# EasyEDA schematic NoiseGen2.json
TITLE: Sheet_1; REV: 1.0; Date: 2023-06-15; Sheet: 1/1; Company: Your Company
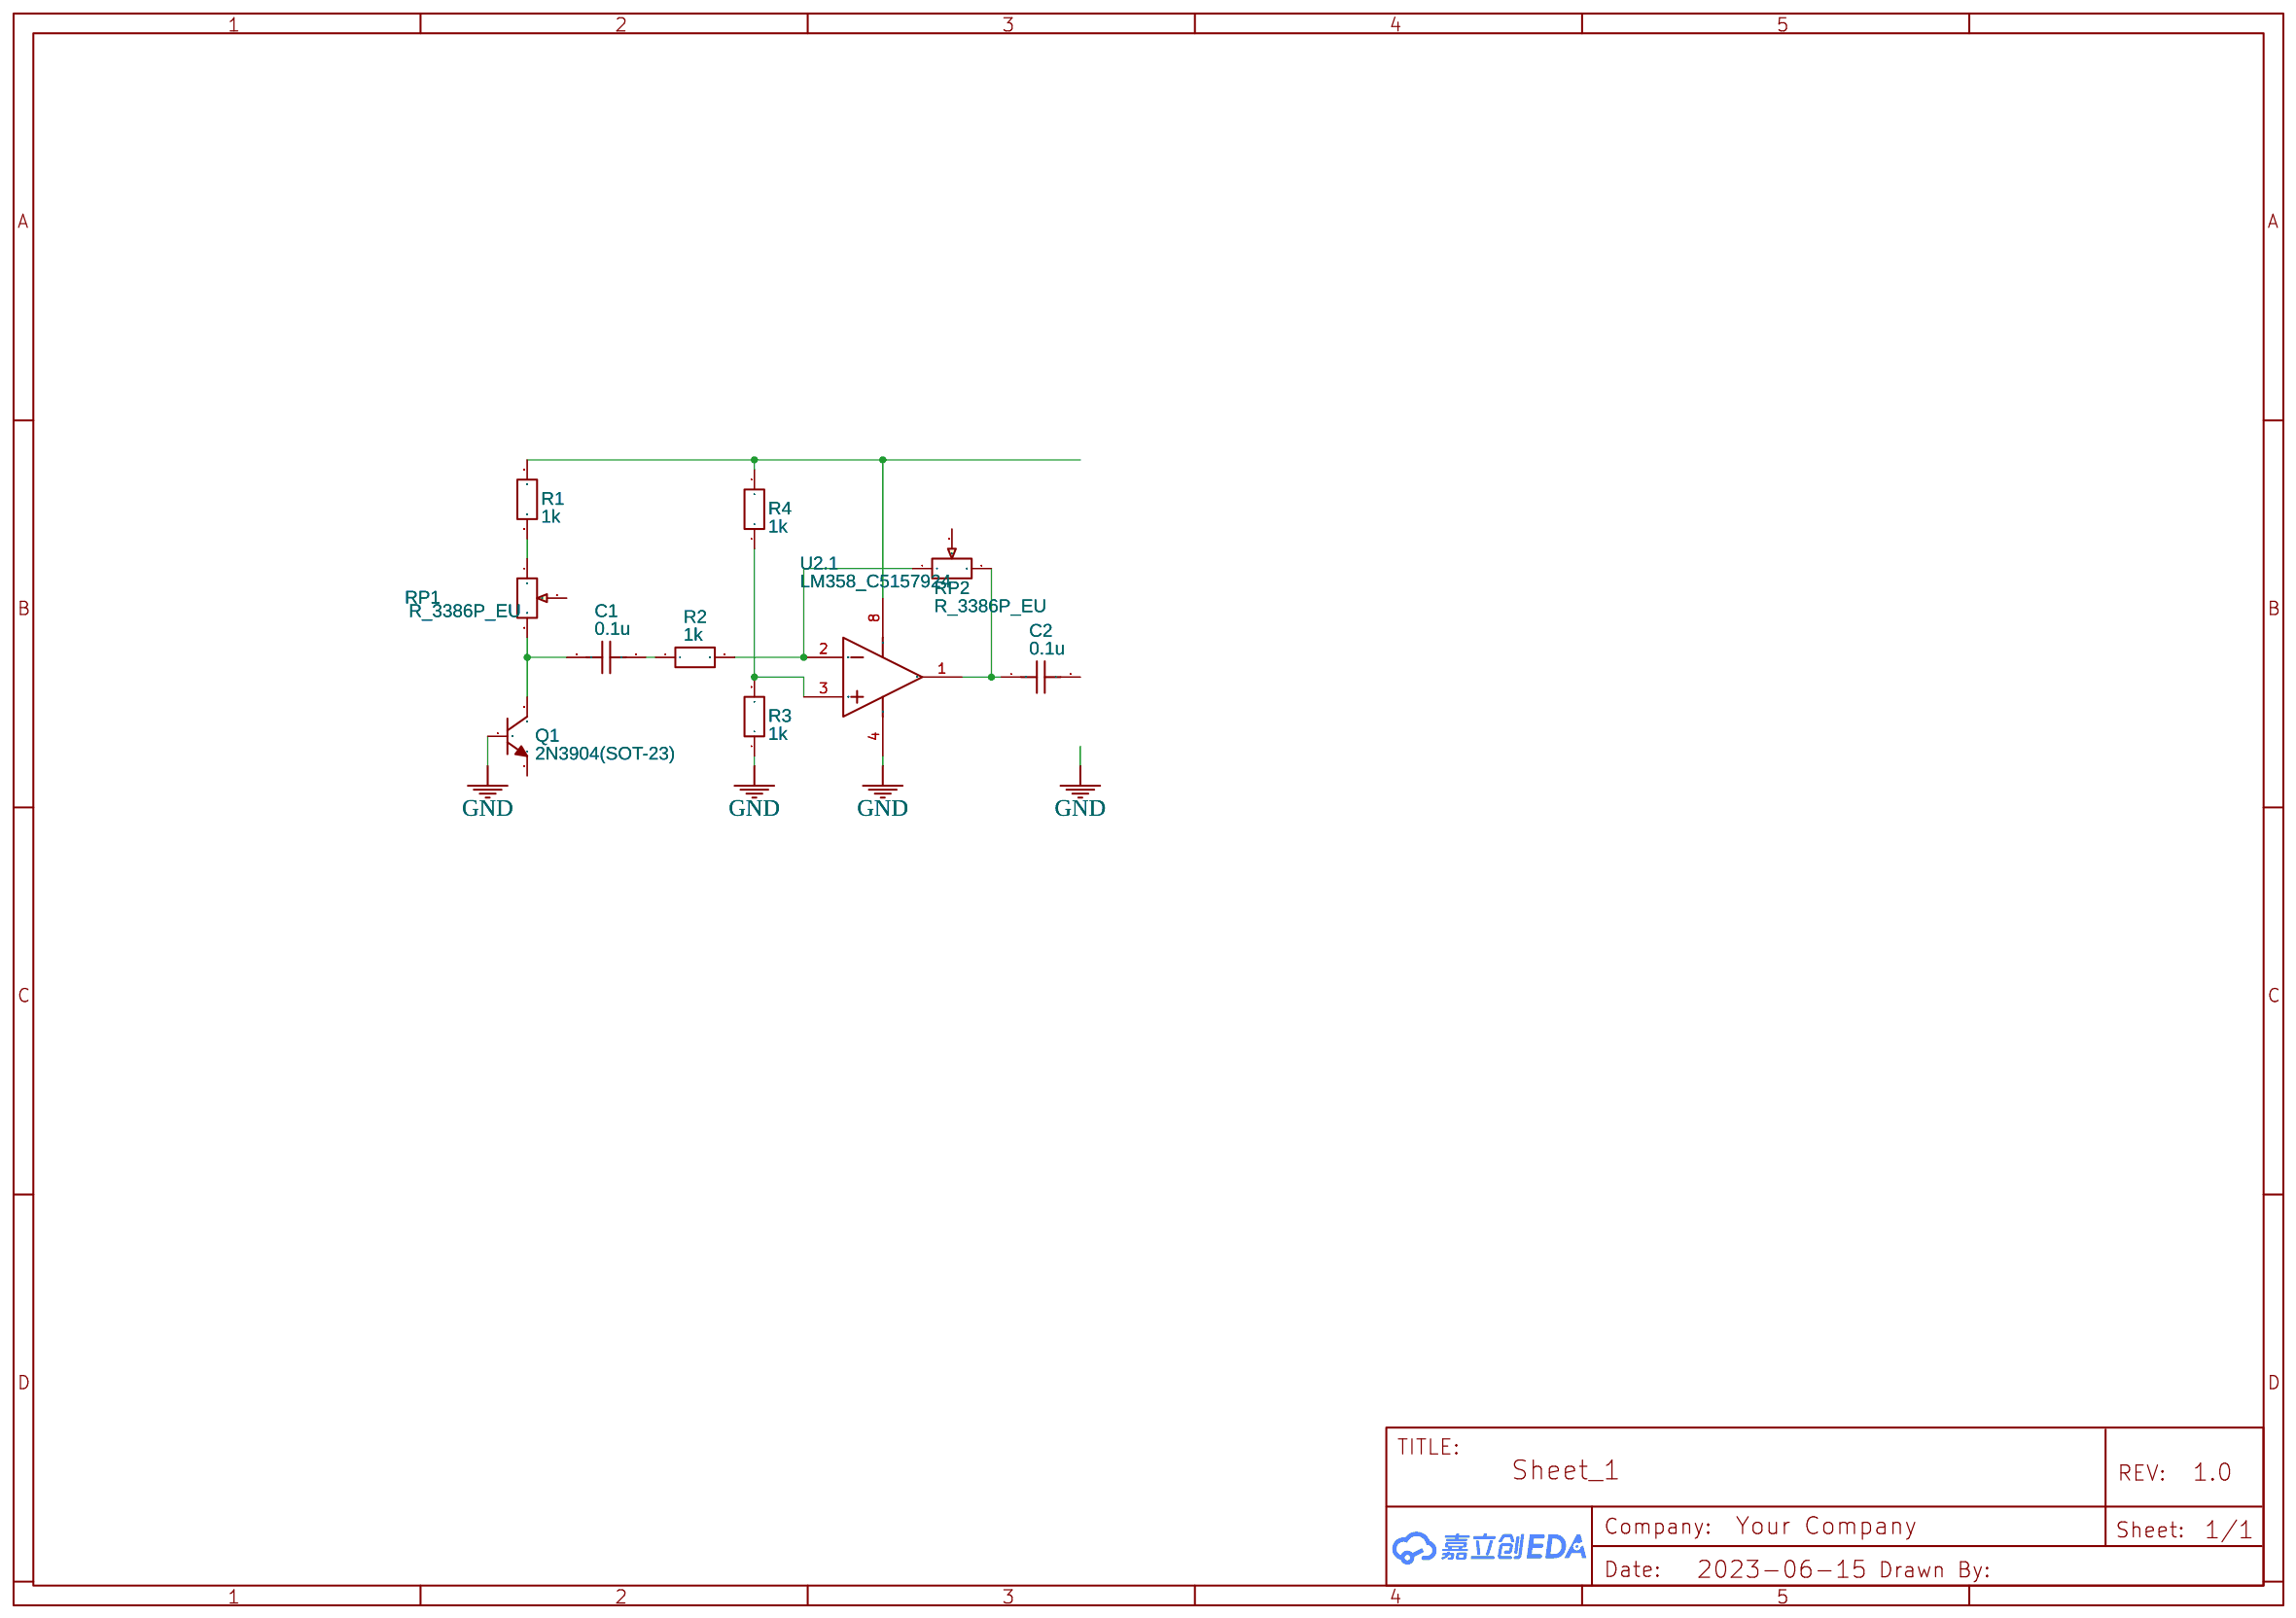
[diagram p0: schematic sheet]

## Parts
C1  0.1u  [C0603]
C2  0.1u  [C0603]
Q1  2N3904(SOT-23)  [SOT-23-3_L2.9-W1.3-P1.90-LS2.4-TR]
R1  1k  [R0603]
R2  1k  [R0603]
R3  1k  [R0603]
R4  1k  [R0603]
RP1  R_3386P_EU  [RHEOSTAT]
RP2  R_3386P_EU  [RHEOSTAT]
U2  LM358_C5157924  [DIP-8_L9.8-W6.4-P2.54-LS7.6-BL]  (section 1)

## Library data of the parts
C1 C2 = C_0603_US: Contributor: LCEDA_Lib
Q1 = 2N3904(SOT-23): Supplier: LCSC; Manufacturer: KEC; Manufacturer Part: 2n3904S-RTK/PS; Supplier Part: C18536; Paste Type: SOT-23; Contributor: LCEDA_Lib
R1-R4 = R_0603_EU: Contributor: LCEDA_Lib
RP1 RP2 = R_3386P_EU: Supplier: LCSC; Contributor: LCEDA_Lib; Value(Ω): 10K
U2 = LM358_C5157924: Supplier: LCSC; Supplier Part: C5157924; Manufacturer: Gcore(扬州国芯); Manufacturer Part: LM358; link: https://atta.szlcsc.com/upload/public/pdf/source/20220906/3ACE6D6B047AB904F15AF865A5390D58.pdf; subpart_no: 1; Contributor: lcsc; JLCPCB Part Class: Extended Part

## Nets
GND: Q1.2(B) R3.1 U2.4(GND)
Net-(C1-1): C1.1 Q1.3(C) RP1.3
Net-(C1-2): C1.2 R2.1
Net-(C2-1): C2.1 RP2.3 U2.1(OUT1)
Net-(R1-1): R1.1 RP1.1
Net-(R1-2): R1.2 R4.2 U2.8(VCC)
Net-(R2-2): R2.2 RP2.1 U2.2(IN1-)
Net-(R3-2): R3.2 R4.1 U2.3(IN1+)

Not connected (* = marked no-connect by the designer): C2 2; Q1 1(E); RP1 2; RP2 2
